# Altium project ciclo_V1.PrjPcb
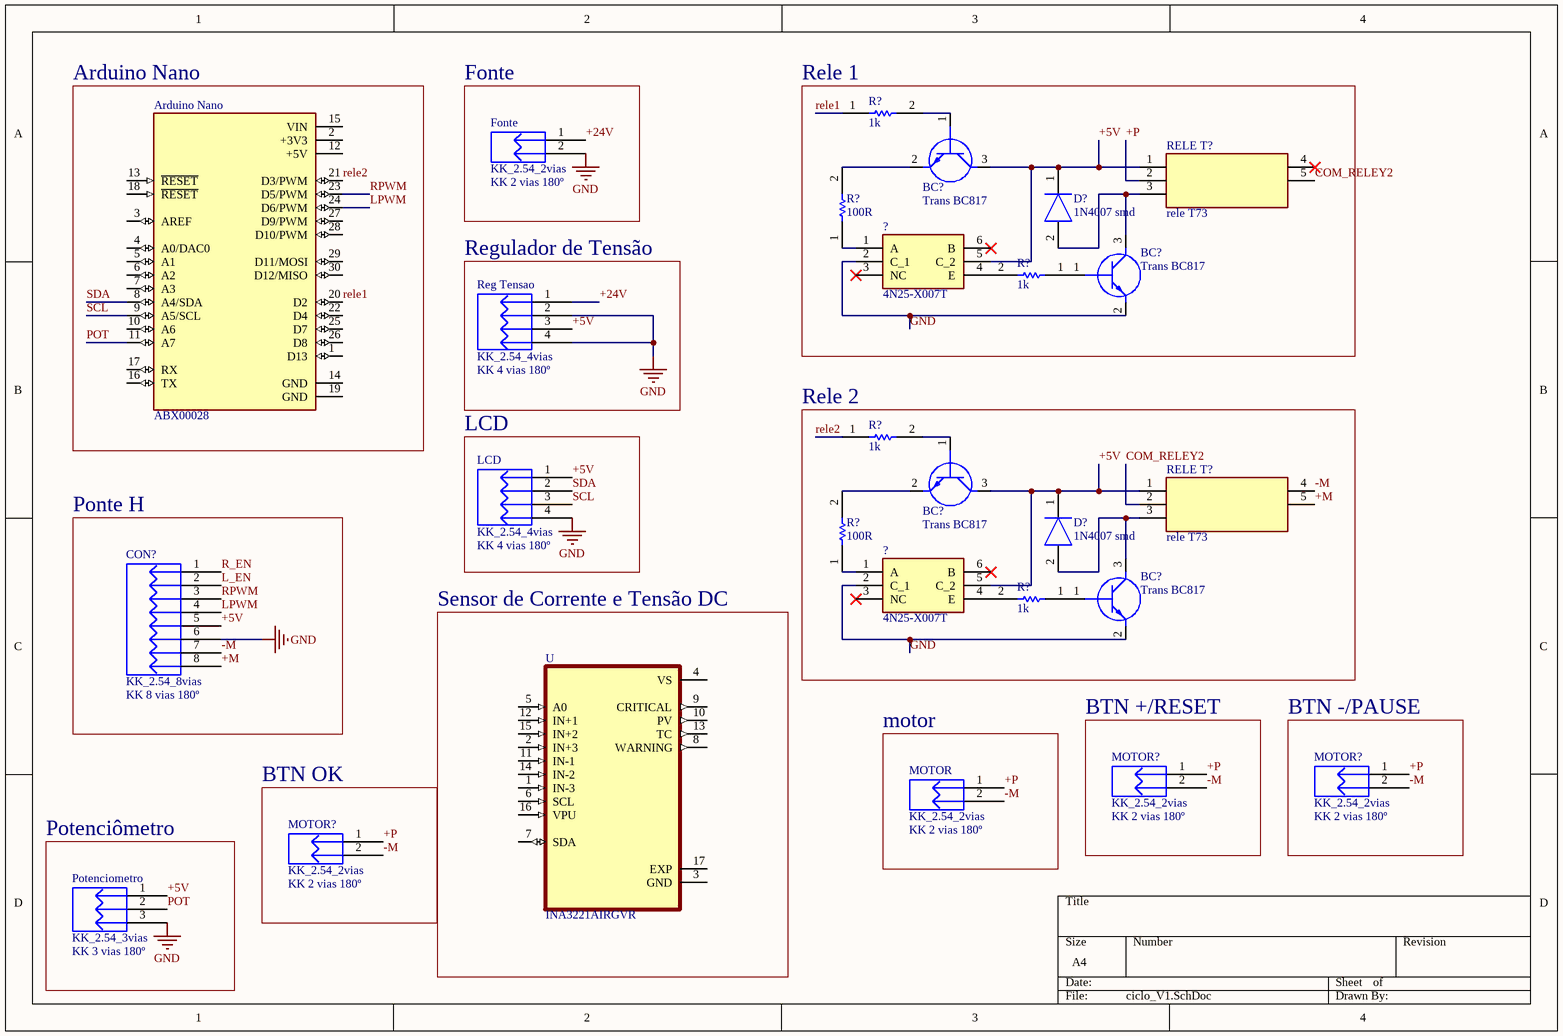
[diagram p0: ciclo_V1.SchDoc]
1 sheet, 27 parts. Net scope: global (net labels, ports and power ports of the same name join across sheets).
Board file: ciclo_V1.PcbDoc

## Sheet ciclo_V1.SchDoc
size A4; SheetNumber: 1; SheetTotal: 1

### Parts
(Parts that share a designator on the sheet are numbered #1, #2 ... from top to bottom, then left to right.)
?#1  4N25-X007T  [SOP254P1030X440-6N]
?#2  4N25-X007T  [SOP254P1030X440-6N]
Arduino_Nano  ABX00028  [MODULE_ABX00028]
BC?#1  Trans BC817  [SOT96P240X110-3N]
BC?#2  Trans BC817  [SOT96P240X110-3N]
BC?#3  Trans BC817  [SOT96P240X110-3N]
BC?#4  Trans BC817  [SOT96P240X110-3N]
CON?  KK_2.54_8vias  Valor: KK 8 vias 180º  [KK_8vias_180°]
D?#1  1N4007 smd  [DIOM5327X242N]
D?#2  1N4007 smd  [DIOM5327X242N]
Fonte  KK_2.54_2vias  Valor: KK 2 vias 180º  [KK_2VIAS_180º]
LCD  KK_2.54_4vias  Valor: KK 4 vias 180º  [KK_4vias_180°]
MOTOR  KK_2.54_2vias  Valor: KK 2 vias 180º  [KK_2VIAS_180º]
MOTOR?#1  KK_2.54_2vias  Valor: KK 2 vias 180º  [KK_2VIAS_180º]
MOTOR?#2  KK_2.54_2vias  Valor: KK 2 vias 180º  [KK_2VIAS_180º]
MOTOR?#3  KK_2.54_2vias  Valor: KK 2 vias 180º  [KK_2VIAS_180º]
Potenciometro  KK_2.54_3vias  Valor: KK 3 vias 180º  [KK_3vias_180º]
R?#1  1k  [RESC3216X60N]
R?#2  100R  [RESC3216X60N]
R?#3  1k  [RESC3216X60N]
R?#4  1k  [RESC3216X60N]
R?#5  100R  [RESC3216X60N]
R?#6  1k  [RESC3216X60N]
Reg_Tensao  KK_2.54_4vias  Valor: KK 4 vias 180º  [KK_4vias_180°]
RELE_T?#1  rele T73  [JQC3FT731Z12VDC]
RELE_T?#2  rele T73  [JQC3FT731Z12VDC]
U  INA3221AIRGVR  [QFN65P400X400X100-17N]

### Blocks framed on the sheet
Arduino Nano: Arduino_Nano
Fonte: Fonte
Rele 1: ?#1 BC?#1 BC?#2 D?#1 R?#1-R?#3 RELE_T?#1
Regulador de Tensão: Reg_Tensao
Rele 2: ?#2 BC?#3 BC?#4 D?#2 R?#4-R?#6 RELE_T?#2
LCD: LCD
Ponte H: CON?
Sensor de Corrente e Tensão DC: U
motor: MOTOR
BTN +/RESET: MOTOR?#1
BTN -/PAUSE: MOTOR?#2
Potenciômetro: Potenciometro
BTN OK: MOTOR?#3

### Nets
GND: ?#1.2(C_1) ?#2.2(C_1) BC?#2.2(E) BC?#4.2(E) CON?.6 Fonte.2 LCD.4 Potenciometro.3 Reg_Tensao.2 Reg_Tensao.4
+5V: ?#1.5(C_2) ?#2.5(C_2) BC?#1.3(C) BC?#3.3(C) CON?.5 D?#1.1(K) D?#2.1(K) LCD.1 Potenciometro.1 Reg_Tensao.3 RELE_T?#1.1(COIL_1) RELE_T?#2.1(COIL_1)
+24V: Fonte.1 Reg_Tensao.1
+M: CON?.8 RELE_T?#2.5(COM)
+P: MOTOR.1 MOTOR?#1.1 MOTOR?#2.1 MOTOR?#3.1 RELE_T?#1.2(NC)
-M: CON?.7 MOTOR.2 MOTOR?#1.2 MOTOR?#2.2 MOTOR?#3.2 RELE_T?#2.4(COIL_2)
COM_RELEY2: RELE_T?#1.5(COM) RELE_T?#2.2(NC)
L_EN: CON?.2
LPWM: Arduino_Nano.24(D6/PWM) CON?.4
POT: Arduino_Nano.11(A7) Potenciometro.2
R_EN: CON?.1
rele1: Arduino_Nano.20(D2) R?#1.1
rele2: Arduino_Nano.21(D3/PWM) R?#4.1
RPWM: Arduino_Nano.23(D5/PWM) CON?.3
SCL: Arduino_Nano.9(A5/SCL) LCD.3
SDA: Arduino_Nano.8(A4/SDA) LCD.2
Net?#1_1: ?#1.1(A) R?#2.1
Net?#1_4: ?#1.4(E) R?#3.2
Net?#2_1: ?#2.1(A) R?#5.1
Net?#2_4: ?#2.4(E) R?#6.2
NetBC?#1_1: BC?#1.1(B) R?#1.2
NetBC?#1_2: BC?#1.2(E) R?#2.2
NetBC?#2_1: BC?#2.1(B) R?#3.1
NetBC?#2_3: BC?#2.3(C) D?#1.2(A) RELE_T?#1.3(NO)
NetBC?#3_1: BC?#3.1(B) R?#4.2
NetBC?#3_2: BC?#3.2(E) R?#5.2
NetBC?#4_1: BC?#4.1(B) R?#6.1
NetBC?#4_3: BC?#4.3(C) D?#2.2(A) RELE_T?#2.3(NO)

Not connected (* = marked no-connect by the designer): ?#1 3(NC)* 6(B)*; ?#2 3(NC)* 6(B)*; Arduino_Nano 1(D13) 2(+3V3) 3(AREF) 4(A0/DAC0) 5(A1) 6(A2) 7(A3) 10(A6) 12(+5V) 13(~{RESET}) 14(GND) 15(VIN) 16(TX) 17(RX) 18(~{RESET}) 19(GND) 22(D4) 25(D7) 26(D8) 27(D9/PWM) 28(D10/PWM) 29(D11/MOSI) 30(D12/MISO); RELE_T?#1 4(COIL_2)*; U 1(IN-3) 2(IN+3) 3(GND) 4(VS) 5(A0) 6(SCL) 7(SDA) 8(WARNING) 9(CRITICAL) 10(PV) 11(IN-1) 12(IN+1) 13(TC) 14(IN-2) 15(IN+2) 16(VPU) 17(EXP)

### Library data of the parts
?#1 ?#2 = 4N25-X007T: Phototransistor; Manufacturer_Name: Vishay; Datasheet Link: https://eu.mouser.com/datasheet/2/427/4n25x000-1767213.pdf; Height: 4.4mm; Manufacturer_Part_Number: 4N25-X007T; Mouser Part Number: 782-4N25-X007T; Mouser Price/Stock: https://www.mouser.com/Search/Refine.aspx?Keyword=782-4N25-X007T; Arrow Part Number: 4N25-X007T; Arrow Price/Stock: https://www.arrow.com/en/products/4n25-x007t/vishay
Arduino_Nano = ABX00028: ATmega4809 Arduino Nano Every AVRÂ® AVR MCU 8-Bit Embedded Evaluation Board; Check_prices: https://www.snapeda.com/parts/ABX00028/Arduino/view-part/3656170/?ref=eda; Availability: In Stock; Value: *; MF: Arduino; Price: None; Purchase-URL: https://pricing.snapeda.com/search/part/ABX00028/?ref=eda; MP: ABX00028; Package: None; SnapEDA_Link: https://www.snapeda.com/parts/ABX00028/Arduino/view-part/3656170/?ref=snap
BC?#1-BC?#4 = Trans BC817: Transistor BJT NPN BC817-25-7-F; Manufacturer_Name: Diodes Inc.; Datasheet Link: https://www.diodes.com/assets/Datasheets/ds11107.pdf; Height: 1.1mm; Manufacturer_Part_Number: BC817-25-7-F; Mouser Part Number: 621-BC817-25-7-F; Mouser Price/Stock: https://www.mouser.co.uk/ProductDetail/Diodes-Incorporated/BC817-25-7-F?qs=rGAXPo9uwV0jK0EyLZnqOw%3D%3D; Arrow Part Number: BC817-25-7-F; Arrow Price/Stock: https://www.arrow.com/en/products/bc817-25-7-f/diodes-incorporated
CON? = KK_2.54_8vias: Conector KK 2.54mm 8 vias; Descrição: Conector KK 3 vias com passo 2.54mm; Encapsulamento: PTH - 180º; Modelo: 3 vias - 180º; Marca: *; Observação: *
D?#1 D?#2 = 1N4007 smd: Diode smd; Manufacturer_Name: Shikues; Datasheet Link: https://datasheet.lcsc.com/szlcsc/SK-1N4007_C126233.pdf; Height: 2.42mm; Manufacturer_Part_Number: 1N4007
Fonte MOTOR MOTOR?#1-MOTOR?#3 = KK_2.54_2vias: Conector KK 2.54mm 2 vias; Descrição: Conector KK 3 vias com passo 2.54mm; Encapsulamento: PTH - 180º; Modelo: 2 vias - 180º; Marca: *; Observação: *
LCD Reg_Tensao = KK_2.54_4vias: Conector KK 2.54mm 4 vias; Descrição: Conector KK 3 vias com passo 2.54mm; Encapsulamento: PTH - 180º; Modelo: 3 vias - 180º; Marca: *; Observação: *
Potenciometro = KK_2.54_3vias: Conector KK 2.54mm 3 vias; Descrição: Conector KK 3 vias com passo 2.54mm; Encapsulamento: PTH - 180º; Modelo: 3 vias - 180º; Marca: *; Observação: *
R?#1-R?#6 = RES 1206: RES 1206 5%; Manufacturer_Name: Vishay; Manufacturer_Part_Number: CRCW12064K70FKEA; Datasheet Link: http://docs-emea.rs-online.com/webdocs/13ec/0900766b813ecc08.pdf; Height: 0.6mm; Mouser Part Number: 71-CRCW1206-4.7K-E3; Mouser Price/Stock: https://www.mouser.co.uk/ProductDetail/Vishay-Dale/CRCW12064K70FKEA?qs=1vm4qhDHCvlKJmatsKzyFQ%3D%3D; Arrow Part Number: CRCW12064K70FKEA; Arrow Price/Stock: https://www.arrow.com/en/products/crcw12064k70fkea/vishay
RELE_T?#1 RELE_T?#2 = rele T73: Relay or Contactor; Manufacturer_Name: QIANJI; Manufacturer_Part_Number: JQC-3F-(T73)-1Z-12VDC; Datasheet Link: https://img.ozdisan.com/ETicaret_Dosya/341245_8627675.pdf; Height: 15.5mm
U = INA3221AIRGVR: 26V, triple channel, 13-bit, i2c output current/voltage monitor w/alerts 16-VQFN -40 to 125; MF: Texas Instruments; Value: *; Price: None; Texas_Instruments-Purchase-URL: https://snapeda.com/shop?store=Texas+Instruments&id=214714; MP: INA3221AIRGVR; Availability: Good; DigiKey-Purchase-URL: https://snapeda.com/shop?store=DigiKey&id=214714; SnapEDA_Link: https://www.snapeda.com/parts/INA3221AIRGVR/Texas%20Instruments/view-part/214714/?ref=snap; Mouser-Purchase-URL: https://snapeda.com/shop?store=Mouser&id=214714; Arrow_Electronics-Purchase-URL: https://snapeda.com/shop?store=Arrow+Electronics&id=214714; Package: VQFN-16 Texas Instruments